# EAGLE design schematics (EAGLE 9.3.0)
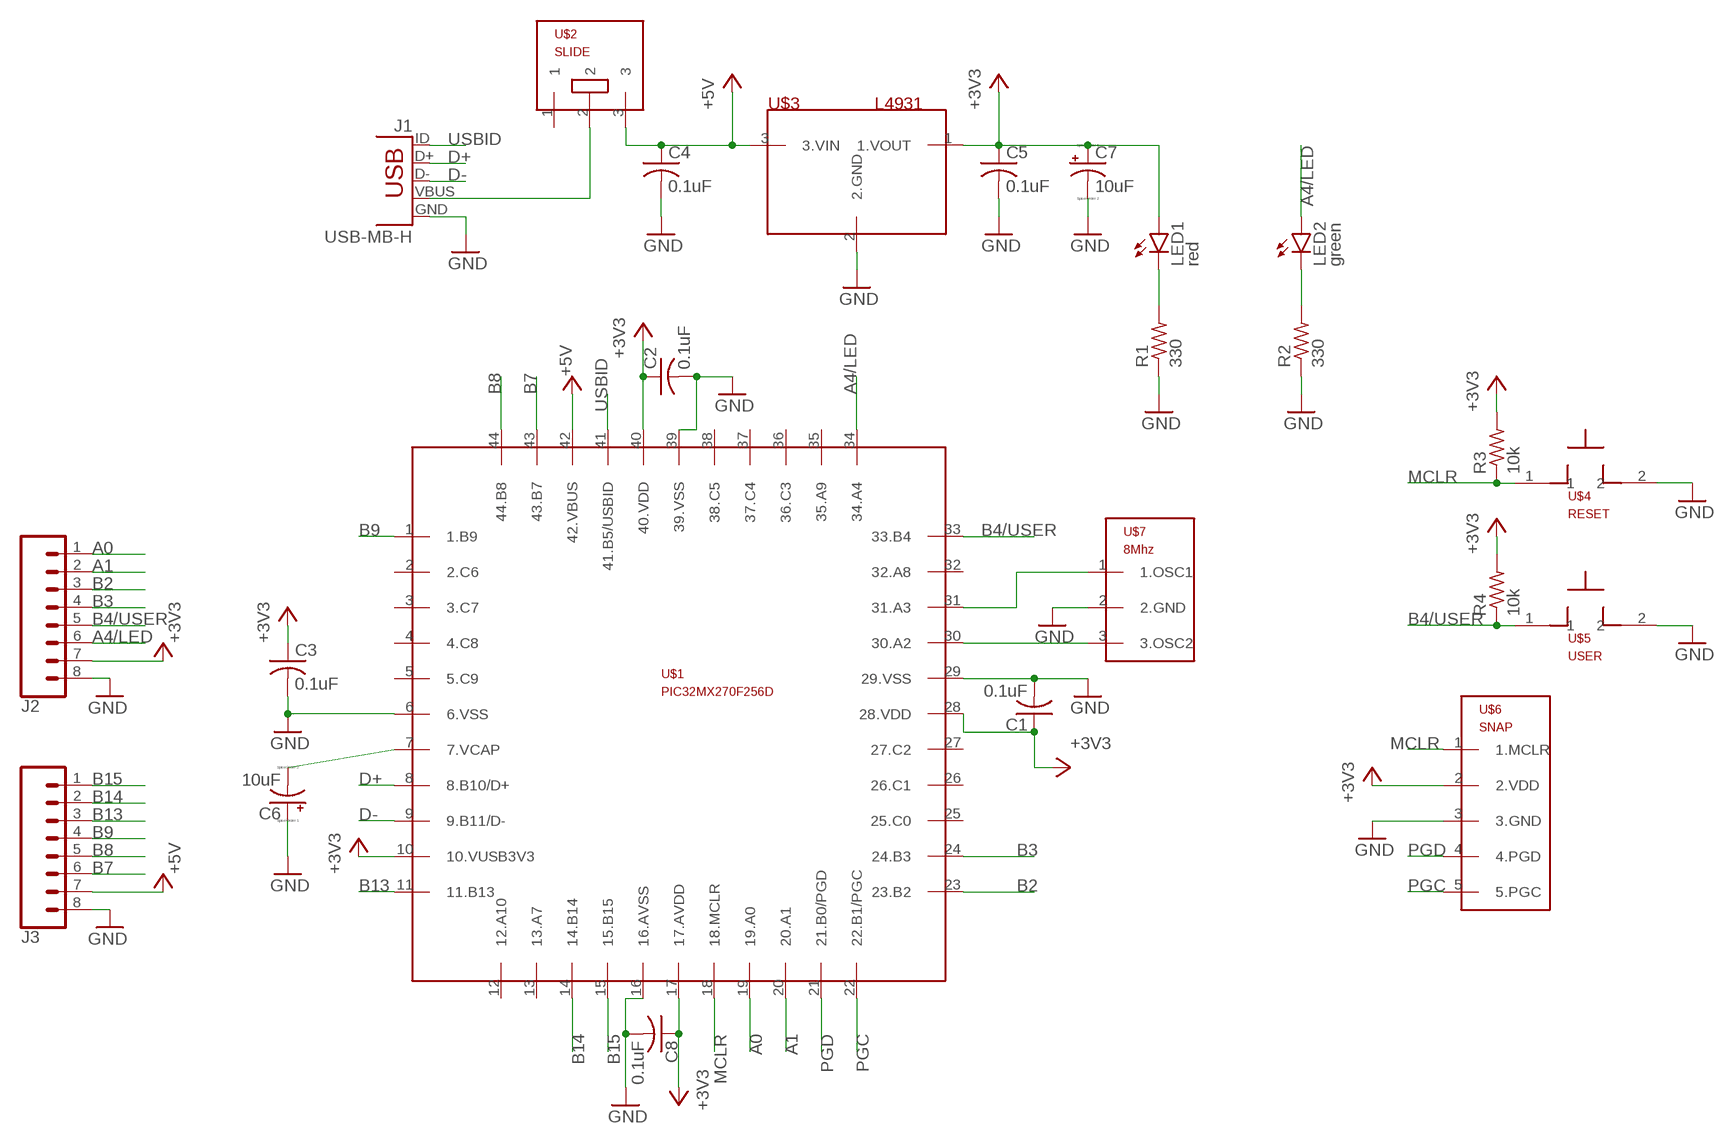
[diagram p0: schematic, sheet 1]

## Parts
C1  0.1uF  C-US025-025X050  [C025-025X050]
C2  0.1uF  C-US025-025X050  [C025-025X050]
C3  0.1uF  C-US025-025X050  [C025-025X050]
C4  0.1uF  C-US025-025X050  [C025-025X050]
C5  0.1uF  C-US025-025X050  [C025-025X050]
C6  10uF  CPOL-USB45181B  [B45181B]
C7  10uF  CPOL-USB45181B  [B45181B]
C8  0.1uF  C-US025-025X050  [C025-025X050]
J1  USB-MB-H  [USB-MB-H]
J2  CONN_08"  [1X08]
J3  CONN_08"  [1X08]
LED1  red  LED3MM  [LED3MM]
LED2  green  LED3MM  [LED3MM]
R1  330  R-US_0207/10  [0207/10]
R2  330  R-US_0207/10  [0207/10]
R3  10k  R-US_0207/10  [0207/10]
R4  10k  R-US_0207/10  [0207/10]
U$1  PIC32MX270F256D  [TQFP44]
U$2  SLIDE  [SLIDE]
U$3  L4931  [TO92]
U$4  RESET  PB  [PB]
U$5  USER  PB  [PB]
U$6  SNAP  [SNAP]
U$7  8Mhz  OSC  [OSC]

## Nets
+3V3: C1.1 C2.1 C3.1 C5.1 C7.+ C8.1 J2.7 LED1.A R3.2 R4.2 U$1.10(10.VUSB3V3) U$1.17(17.AVDD) U$1.28(28.VDD) U$1.40(40.VDD) U$3.1(1.VOUT) U$6.2(2.VDD)
+5V: C4.1 J3.7 U$1.42(42.VBUS) U$2.3 U$3.3(3.VIN)
A0: J2.1 U$1.19(19.A0)
A1: J2.2 U$1.20(20.A1)
A4/LED: J2.6 LED2.A U$1.34(34.A4)
B2: J2.3 U$1.23(23.B2)
B3: J2.4 U$1.24(24.B3)
B4/USER: J2.5 R4.1 U$1.33(33.B4) U$5.1
B7: J3.6 U$1.43(43.B7)
B8: J3.5 U$1.44(44.B8)
B9: J3.4 U$1.1(1.B9)
B13: J3.3 U$1.11(11.B13)
B14: J3.2 U$1.14(14.B14)
B15: J3.1 U$1.15(15.B15)
D+: J1.D+ U$1.8(8.B10/D+)
D-: J1.D- U$1.9(9.B11/D-)
GND: C1.2 C2.2 C3.2 C4.2 C5.2 C6.+ C7.- C8.2 J1.GND J2.8 J3.8 R1.1 R2.1 U$1.6(6.VSS) U$1.16(16.AVSS) U$1.29(29.VSS) U$1.39(39.VSS) U$3.2(2.GND) U$4.2 U$5.2 U$6.3(3.GND) U$7.2(2.GND)
MCLR: R3.1 U$1.18(18.MCLR) U$4.1 U$6.1(1.MCLR)
N$1: C6.- U$1.7(7.VCAP)
N$2: J1.VBUS U$2.2
N$3: LED2.K(C) R2.2
N$4: LED1.K(C) R1.2
N$5: U$1.30(30.A2) U$7.3(3.OSC2)
N$6: U$1.31(31.A3) U$7.1(1.OSC1)
PGC: U$1.22(22.B1/PGC) U$6.5(5.PGC)
PGD: U$1.21(21.B0/PGD) U$6.4(4.PGD)
USBID: J1.ID U$1.41(41.B5/USBID)
Unconnected: U$1.2(2.C6) U$1.3(3.C7) U$1.4(4.C8) U$1.5(5.C9) U$1.12(12.A10) U$1.13(13.A7) U$1.25(25.C0) U$1.26(26.C1) U$1.27(27.C2) U$1.32(32.A8) U$1.35(35.A9) U$1.36(36.C3) U$1.37(37.C4) U$1.38(38.C5) U$2.1

## Library data of the parts
C1-C5 C8 = custom_lib:C-US: CAPACITOR, American symbol
C6 C7 = custom_lib:CPOL-US: POLARIZED CAPACITOR, American symbol
J1 = custom_lib:USB: USB Connectors USB-B-PTH is fully proven SKU : PRT-00139/CONN-08278 USB-miniB is fully proven SKU : PRT-00587 USB-A-PCB is untested. USB-A-H is throughly reviewed, but untested. Spark Fun Electronics SKU : PRT-00437 USB-B-SMT is throughly reviewed, but untested. Needs silkscreen touching up. USB-A-S has not been used/tested USB-MB-H has not been used/tested USB-MICROB has been used. CONN-09505
J2 J3 = custom_lib:CONN_08: Multi connection point. Often used as Generic Header-pin footprint for 0.1 inch spaced/style header connections On any of the 0.1 inch spaced packages, you can populate with these: Break Away Headers - Straight <https://www.sparkfun.com/products/116> (PRT-00116) Break Away Male Headers - Right Angle <https://www.sparkfun.com/products/553> (PRT-00553) Female Headers <https://www.sparkfun.com/products/115> (PRT-00115) Break Away Headers - Machine Pin <https://www.sparkfun.com/products/117> (PRT-00117) Break Away Female Headers - Swiss Machine Pin <https://www.sparkfun.com/products/743> (PRT-00743) Arduino Stackable Header - 8 Pin <https://www.sparkfun.com/products/9279> (PRT-09279) For SCREWTERMINALS and SPRING TERMINALS visit here: Screw Terimnals on SparkFun.com <https://www.sparkfun.com/search/results?term=Screw+Terminals> (5mm/3.5mm/2.54mm spacing) This device is also useful as a general connection point to wire up your design to another part of your project. Our various solder wires solder well into these plated through hole pads. Hook-Up Wire - Assortment (Stranded, 22 AWG) <https://www.sparkfun.com/products/11375> (PRT-11375) Hook-Up Wire - Assortment (Solid Core, 22 AWG) <https://www.sparkfun.com/products/11367> (PRT-11367) View the entire wire category on our website here <https://www.sparkfun.com/categories/141> Special notes: Molex polarized connector foot print use with SKU : PRT-08231 with associated crimp pins and housings. 1MM SMD Version SKU: PRT-10208 NOTES ON THE VARIANTS LOCK and LOCK_LONGPADS... This footprint was designed to help hold the alignment of a through-hole component (i.e. 6-pin header) while soldering it into place. You may notice that each hole has been shifted either up or down by 0.005 of an inch from it's more standard position (which is a perfectly straight line). This slight alteration caused the pins (the squares in the middle) to touch the edges of the holes. Because they are alternating, it causes a "brace" to hold the component in place. 0.005 has proven to be the perfect amount of "off-center" position when using our standard breakaway headers. Although looks a little odd when you look at the bare footprint, once you have a header in there, the alteration is very hard to notice. Also,if you push a header all the way into place, it is covered up entirely on the bottom side.; PROD_ID: CONN-08438
LED1 LED2 = custom_lib:LED: LED OSRAM: - CHIPLED LG R971, LG N971, LY N971, LG Q971, LY Q971, LO R971, LY R971 LH N974, LH R974 LS Q976, LO Q976, LY Q976 LO Q996 - Hyper CHIPLED LW Q18S LB Q993, LB Q99A, LB R99A - SideLED LS A670, LO A670, LY A670, LG A670, LP A670 LB A673, LV A673, LT A673, LW A673 LH A674 LY A675 LS A676, LA A676, LO A676, LY A676, LW A676 LS A679, LY A679, LG A679 - Hyper Micro SIDELED® LS Y876, LA Y876, LO Y876, LY Y876 LT Y87S - SmartLED LW L88C, LW L88S LB L89C, LB L89S, LG L890 LS L89K, LO L89K, LY L89K LS L896, LA L896, LO L896, LY L896 - TOPLED LS T670, LO T670, LY T670, LG T670, LP T670 LSG T670, LSP T670, LSY T670, LOP T670, LYG T670 LG T671, LOG T671, LSG T671 LB T673, LV T673, LT T673, LW T673 LH T674 LS T676, LA T676, LO T676, LY T676, LB T676, LH T676, LSB T676, LW T676 LB T67C, LV T67C, LT T67C, LS T67K, LO T67K, LY T67K, LW E67C LS E67B, LA E67B, LO E67B, LY E67B, LB E67C, LV E67C, LT E67C LW T67C LS T679, LY T679, LG T679 LS T770, LO T770, LY T770, LG T770, LP T770 LB T773, LV T773, LT T773, LW T773 LH T774 LS E675, LA E675, LY E675, LS T675 LS T776, LA T776, LO T776, LY T776, LB T776 LHGB T686 LT T68C, LB T68C - Hyper Mini TOPLED® LB M676 - Mini TOPLED Santana® LG M470 LS M47K, LO M47K, LY M47K Source: http://www.osram.convergy.de LUXEON: - LUMILED® LXK2-PW12-R00, LXK2-PW12-S00, LXK2-PW14-U00, LXK2-PW14-V00 LXK2-PM12-R00, LXK2-PM12-S00, LXK2-PM14-U00 LXK2-PE12-Q00, LXK2-PE12-R00, LXK2-PE12-S00, LXK2-PE14-T00, LXK2-PE14-U00 LXK2-PB12-K00, LXK2-PB12-L00, LXK2-PB12-M00, LXK2-PB14-N00, LXK2-PB14-P00, LXK2-PB14-Q00 LXK2-PR12-L00, LXK2-PR12-M00, LXK2-PR14-Q00, LXK2-PR14-R00 LXK2-PD12-Q00, LXK2-PD12-R00, LXK2-PD12-S00 LXK2-PH12-R00, LXK2-PH12-S00 LXK2-PL12-P00, LXK2-PL12-Q00, LXK2-PL12-R00 Source: www.luxeon.com KINGBRIGHT: KA-3528ASYC Source: www.kingbright.com
R1-R4 = custom_lib:R-US_: RESISTOR, American symbol
U$1 = custom_lib:PIC32MX270F256D
U$2 = custom_lib:SLIDE
U$3 = custom_lib:L4931
U$4 U$5 = custom_lib:PB
U$6 = custom_lib:SNAP
U$7 = custom_lib:OSC

## Board
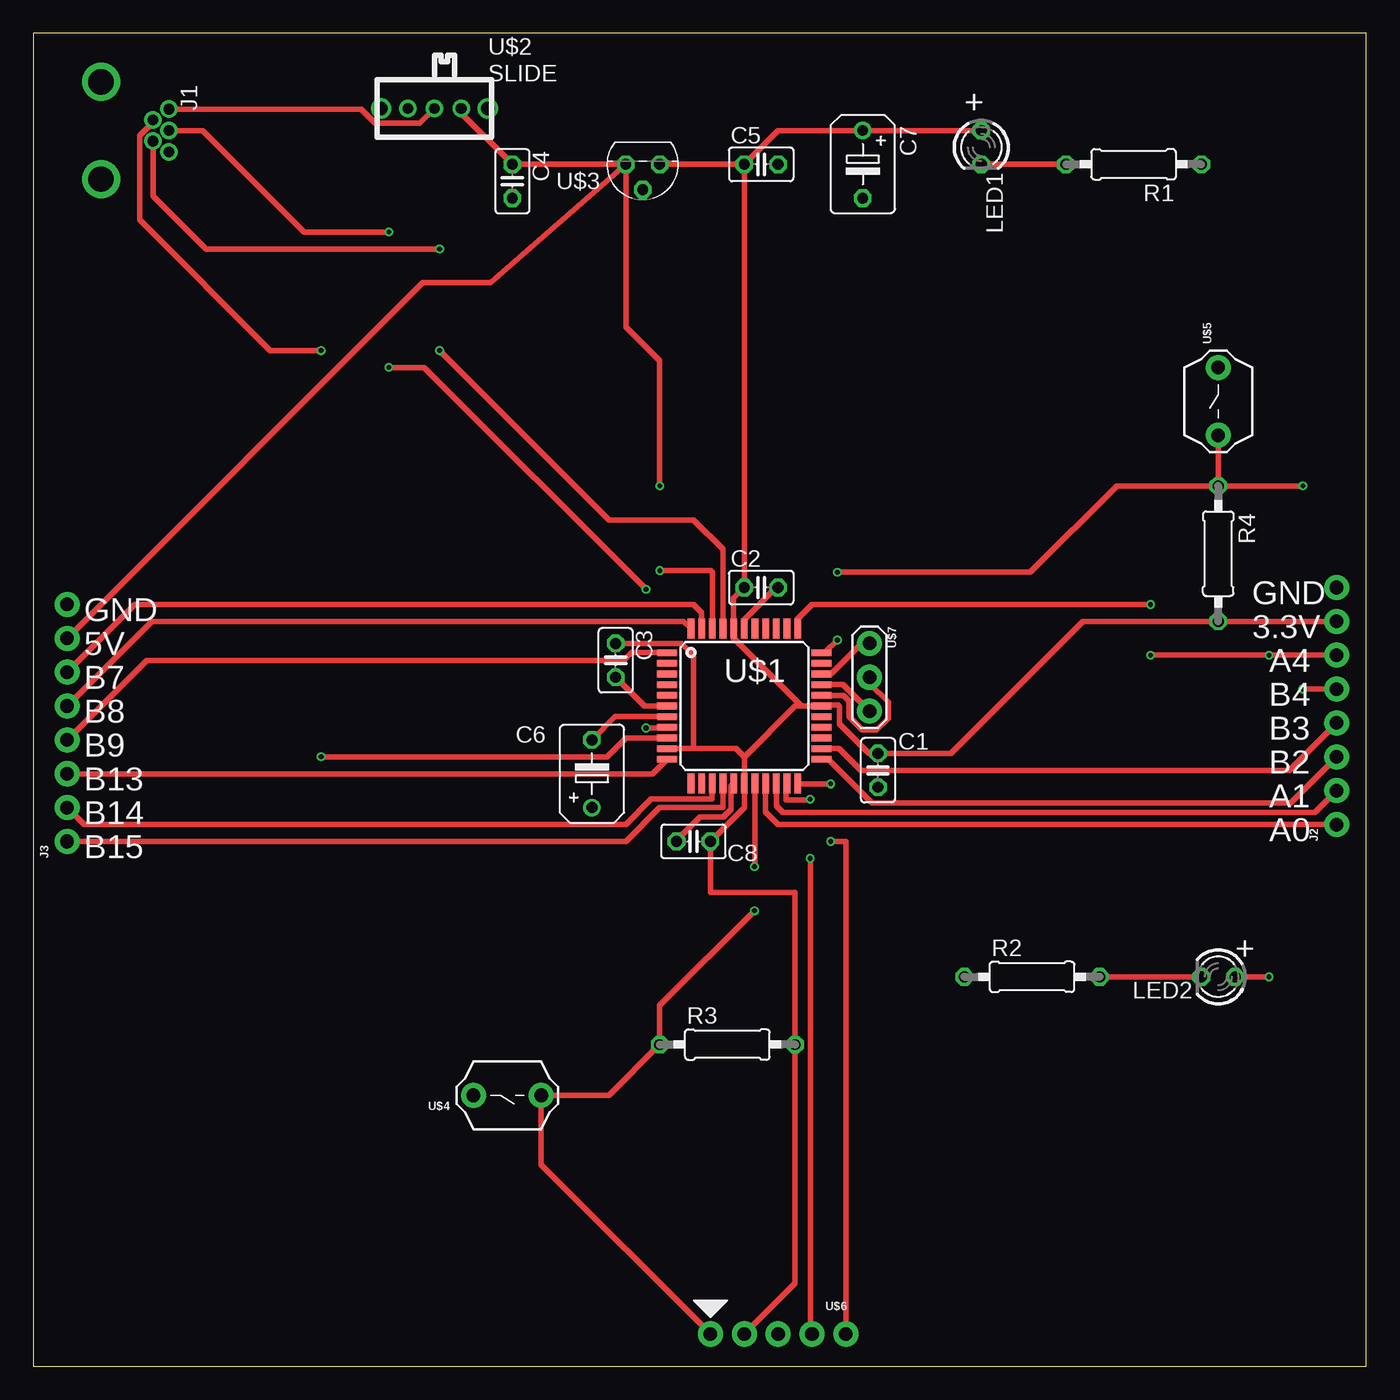
[diagram p1: board, top side]
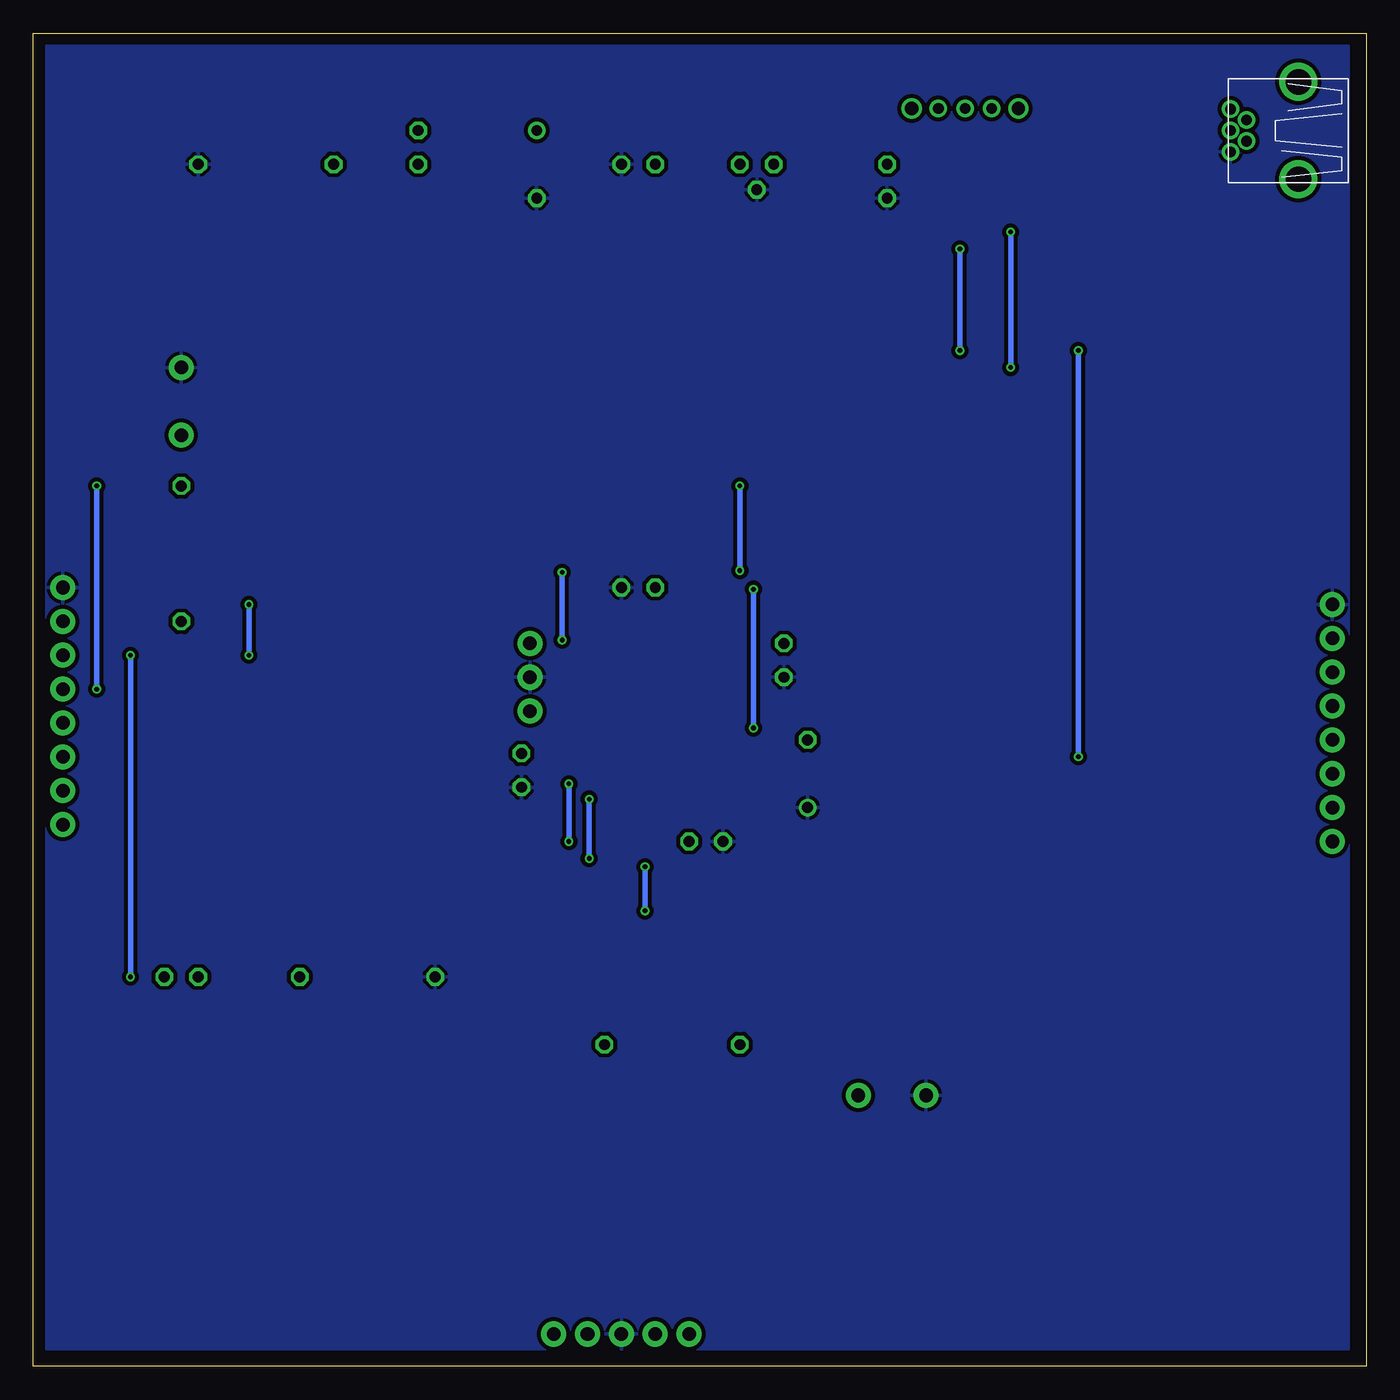
[diagram p2: board, bottom side, seen from below]

Size 100 x 100 mm. Coordinates in mm from the lower left corner, seen from the top.
Outline: 0,0 100,0 100,100 0,100 0,0
Copper layers (1*16): Top 0.035mm / dielectric 1.5mm / Bottom 0.035mm
Design rules "SeeedStudio_2layer_DRU_no_angle_20140221": minimum track width 6mil, minimum drill 12mil, track to track 6mil, track to pad 6mil, pad to pad 6mil, via to via 6mil, smd to smd 0mil, copper to edge 10mil, drill to drill 10mil, minimum pad ring 10mil, minimum via ring 6mil, stop-mask expansion 2mil, vias tented up to drill 100mil, thermal gap 10mil

### Footprints (pad centres in the part's own frame; a part is rotated, then mirrored left to right if it is on the bottom)
C025-025X050 = drill 0.813 octagon: 1 -1.27,0; 2 1.27,0
B45181B = drill 0.813: + -2.54,0 | drill 0.813 octagon: - 2.54,0
USB-MB-H = drill 0.8: D+ 5.1,0; D- 3.9,0.8; GND 5.1,-1.6; ID 3.9,-0.8; VBUS 5.1,1.6 | drill 1.9: P$6 0,-3.65; P$7 0,3.65
1X08 = drill 1.016 pad 1.88: 1 0,0; 2 2.54,0; 3 5.08,0; 4 7.62,0; 5 10.16,0; 6 12.7,0; 7 15.24,0; 8 17.78,0
LED3MM = drill 0.813 octagon: A -1.27,0; K 1.27,0
0207/10 = drill 0.813 octagon: 1 -5.08,0; 2 5.08,0
TQFP44 = smd 1.5 x 0.5: 1 -5.8,4; 2 -5.8,3.2; 3 -5.8,2.4; 4 -5.8,1.6; 5 -5.8,0.8; 6 -5.8,0; 7 -5.8,-0.8; 8 -5.8,-1.6; 9 -5.8,-2.4; 10 -5.8,-3.2; 11 -5.8,-4; 23 5.8,-4; 24 5.8,-3.2; 25 5.8,-2.4; 26 5.8,-1.6; 27 5.8,-0.8; 28 5.8,0; 29 5.8,0.8; 30 5.8,1.6; 31 5.8,2.4; 32 5.8,3.2; 33 5.8,4 | smd 0.5 x 1.5: 12 -4,-5.8; 13 -3.2,-5.8; 14 -2.4,-5.8; 15 -1.6,-5.8; 16 -0.8,-5.8; 17 0,-5.8; 18 0.8,-5.8; 19 1.6,-5.8; 20 2.4,-5.8; 21 3.2,-5.8; 22 4,-5.8; 34 4,5.8; 35 3.2,5.8; 36 2.4,5.8; 37 1.6,5.8; 38 0.8,5.8; 39 0,5.8; 40 -0.8,5.8; 41 -1.6,5.8; 42 -2.4,5.8; 43 -3.2,5.8; 44 -4,5.8
SLIDE = drill 0.8: 1 -2,0; 2 0,0; 3 2,0 | drill 1: P$1 -4,0; P$2 4,0
TO92 = drill 0.813 octagon: 1 -1.27,0; 2 0,1.905; 3 1.27,0
PB = drill 1.016 pad 1.88: 1 -2.54,0; 2 2.54,0
SNAP = drill 1.016 pad 1.88: 1 -5.08,0; 2 -2.54,0; 3 0,0; 4 2.54,0; 5 5.08,0
OSC = drill 1.016 pad 1.88: 1 -2.54,0; 2 0,0; 3 2.54,0

### Placement (x,y rotation side)
C1  63.37,44.7 270 top
C2  54.61,58.42 0 top
C3  43.69,52.96 270 top
C4  35.94,88.9 270 top
C5  54.61,90.17 0 top
C6  41.91,44.45 90 top
C7  62.23,90.17 270 top
C8  49.53,39.37 180 top
J1  5.08,92.71 0 top
J2  97.79,40.64 90 top
J3  2.54,39.37 90 top
LED1  71.12,91.44 270 top
LED2  88.9,29.21 180 top
R1  82.55,90.17 180 top
R2  74.93,29.21 0 top
R3  52.07,24.13 0 top
R4  88.9,60.96 270 top
U$1  53.34,49.53 0 top
U$2  30.1,94.36 0 top
U$3  45.72,90.17 180 top
U$4  35.56,20.32 180 top
U$5  88.9,72.39 90 top
U$6  55.88,2.41 0 top
U$7  62.74,51.69 270 top

### Tracks (layer width: path | path; a pad name or v marks a point on that pad's centre or on a via)
+3V3
  Top 0.406: U$3.1 C5.1 | C5.1 55.88,92.71 C7.+ LED1.A | C5.1 C2.1 52.54,57.62 U$1.40 52.48,55.27 52.48,54.69 57.64,49.53 U$1.28 | U$1.28 57.15,49.53 53.34,45.72 | 53.34,45.72 U$1.17 53.34,41.91 C8.1 50.8,35.56 57.15,35.56 R3.2 57.15,6.22 U$6.2 | J2.7 R4.2 78.74,55.88 68.83,45.97 C1.1 62.7,45.97 60.5,48.17 60.5,49.51 60.42,49.59 59.2,49.59 U$1.28 | 53.34,45.72 52.73,46.33 49.53,46.33 | 49.53,46.33 U$1.10 | C3.1 48.64,54.23 49.53,53.34 49.53,46.33
+5V  (via drill 0.35)
  Top 0.406: U$2.3 32.1,94.01 C4.1 U$3.3 | U$3.3 44.45,77.99 44.46,77.97 46.99,75.44 v46.99,66.04 | J3.7 29.21,81.28 30.48,81.28 34.29,81.28 U$3.3 | v46.99,59.69 50.8,59.69 50.94,59.55 U$1.42
  Bottom 0.406: v46.99,59.69 v46.99,66.04
A0
  Top 0.406: U$1.19 54.94,41.58 55.88,40.64 J2.1
A1
  Top 0.406: U$1.20 55.74,42.05 56.26,41.53 96.14,41.53 J2.2
A4/LED  (via drill 0.35)
  Top 0.406: LED2.A v92.71,29.21 | J2.6 v92.71,53.34 v83.82,53.34 | U$1.34 57.34,56.07 58.42,57.15 v83.82,57.15
  Bottom 0.406: v92.71,53.34 v92.71,29.21 | v83.82,57.15 v83.82,53.34
B2
  Top 0.406: J2.3 94.33,42.26 62.92,42.26 59.65,45.53 U$1.23
B3
  Top 0.406: U$1.24 59.16,46.35 60.45,46.35 62.1,44.7 94.23,44.7 J2.4
B4/USER  (via drill 0.35)
  Top 0.406: R4.1 U$5.1 | R4.1 v95.25,66.04 | v95.25,50.8 J2.5 | U$1.33 59.37,53.53 v60.33,54.48 | R4.1 81.28,66.04 74.8,59.56 v60.33,59.56
  Bottom 0.406: v95.25,66.04 v95.25,50.8 | v60.33,59.56 v60.33,54.48
B7
  Top 0.406: U$1.43 50.14,56.54 49.53,57.15 7.62,57.15 J3.6
B8
  Top 0.406: U$1.44 48.79,55.88 8.89,55.88 J3.5
B9
  Top 0.406: U$1.1 44.89,53.53 44.32,52.96 8.51,52.96 J3.4
B13
  Top 0.406: J3.3 46.46,44.45 U$1.11
B14
  Top 0.406: J3.2 3.81,40.64 44.45,40.64 46.35,42.55 50.93,42.55 50.93,43.72 U$1.14
B15
  Top 0.406: J3.1 44.45,39.37 46.99,41.91 51.69,41.91 51.74,41.96 U$1.15
D+  (via drill 0.35)
  Top 0.406: J1.D+ 12.7,92.71 20.32,85.09 v26.67,85.09 | v45.97,58.29 29.34,74.93 v26.67,74.93 | v45.97,47.88 47.49,47.88 U$1.8
  Bottom 0.406: v26.67,85.09 v26.67,74.93 | v45.97,58.29 v45.97,47.88
D-  (via drill 0.35)
  Top 0.406: J1.D- 8.98,93.34 7.97,92.33 7.97,86.01 17.78,76.2 v21.59,76.2 | U$1.9 47.53,47.12 45.47,47.12 44.45,47.12 43.05,45.72 v21.59,45.72
  Bottom 0.406: v21.59,76.2 v21.59,45.72
GND
  Top 0.406: U$1.29 60.77,50.33 61.19,49.91 61.19,48.74 62.2,47.73 63.27,47.73 64.16,48.61 64.16,49.81 62.74,51.23 U$7.2 | C3.2 45.85,49.53 U$1.6 | C2.2 55.73,58.42 53.34,56.03 U$1.39 | C8.2 48.26,39.45 50.03,41.22 51.79,41.22 52.35,41.78 52.35,43.54 U$1.16
  pour Bottom (isolate 0.305): 1.27,99.06 99.06,99.06 99.06,1.27 1.27,1.27
MCLR  (via drill 0.35)
  Top 0.406: U$6.1 38.1,15.11 U$4.1 43.18,20.32 R3.1 46.99,27.05 v54.1,34.16 | U$1.18 54.14,37.5 v54.1,37.47
  Bottom 0.406: v54.1,37.47 v54.1,34.16
N$1
  Top 0.406: U$1.7 43.65,48.73 C6.-
N$2
  Top 0.406: J1.VBUS 24.58,94.31 25.64,93.25 28.99,93.25 U$2.2
N$3
  Top 0.406: R2.2 LED2.K
N$4
  Top 0.406: LED1.K R1.2
N$5
  Top 0.406: U$1.30 60.76,51.13 U$7.3
N$6
  Top 0.406: U$7.1 62.14,54.23 59.84,51.93 U$1.31
PGC  (via drill 0.35)
  Top 0.406: U$6.5 60.96,39.37 v59.82,39.37 | v59.82,43.69 57.38,43.69 U$1.22
  Bottom 0.406: v59.82,39.37 v59.82,43.69
PGD  (via drill 0.35)
  Top 0.406: v58.29,38.1 58.29,2.54 U$6.4 | v58.29,42.55 58.24,42.5 56.48,42.5 56.48,43.67 U$1.21
  Bottom 0.406: v58.29,38.1 v58.29,42.55
USBID  (via drill 0.35)
  Top 0.406: U$1.41 51.74,61.29 49.53,63.5 43.18,63.5 v30.48,76.2 | v30.48,83.82 12.95,83.82 8.98,87.79 J1.ID
  Bottom 0.406: v30.48,76.2 v30.48,83.82

### Text on the board
tPlace: + | GND | GND | 3.3V | 5V | A4 | B7 | B4 | B8 | B3 | B9 | B2 | B13 | A1 | B14 | A0 | B15 | +